# EAGLE schematic 1203_05 (EAGLE 7.1.0)
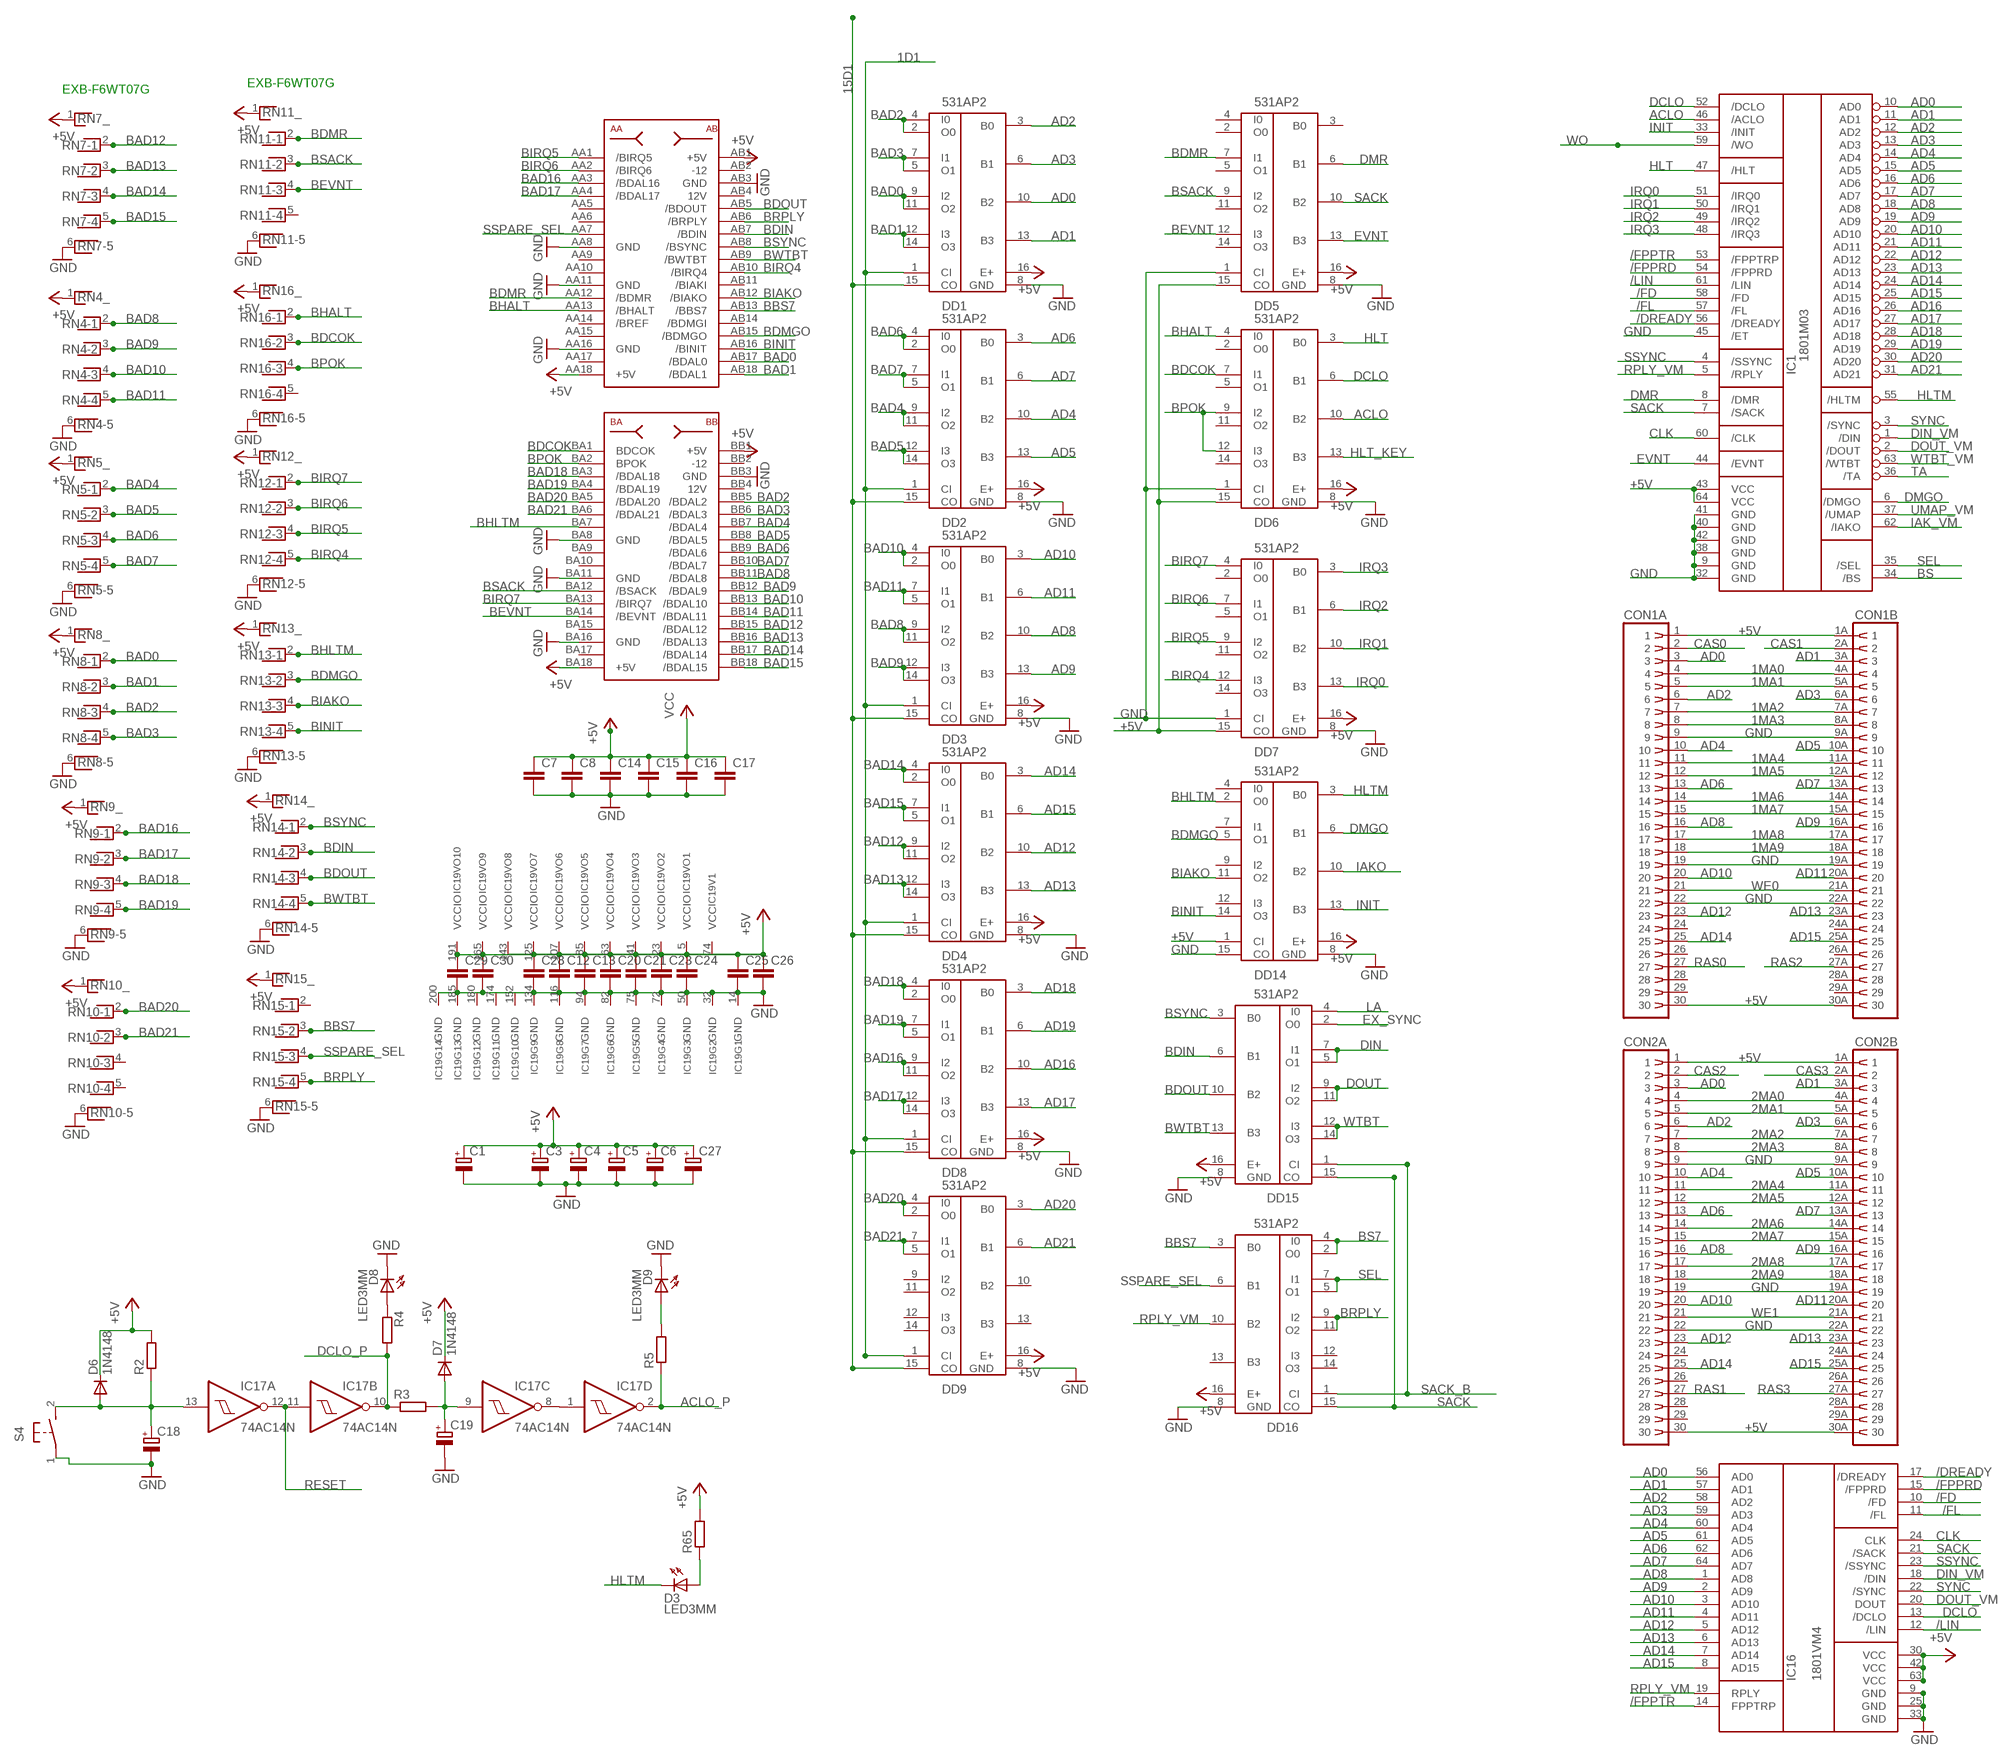
[diagram p0: schematic, sheet 1, part 1 of 2]
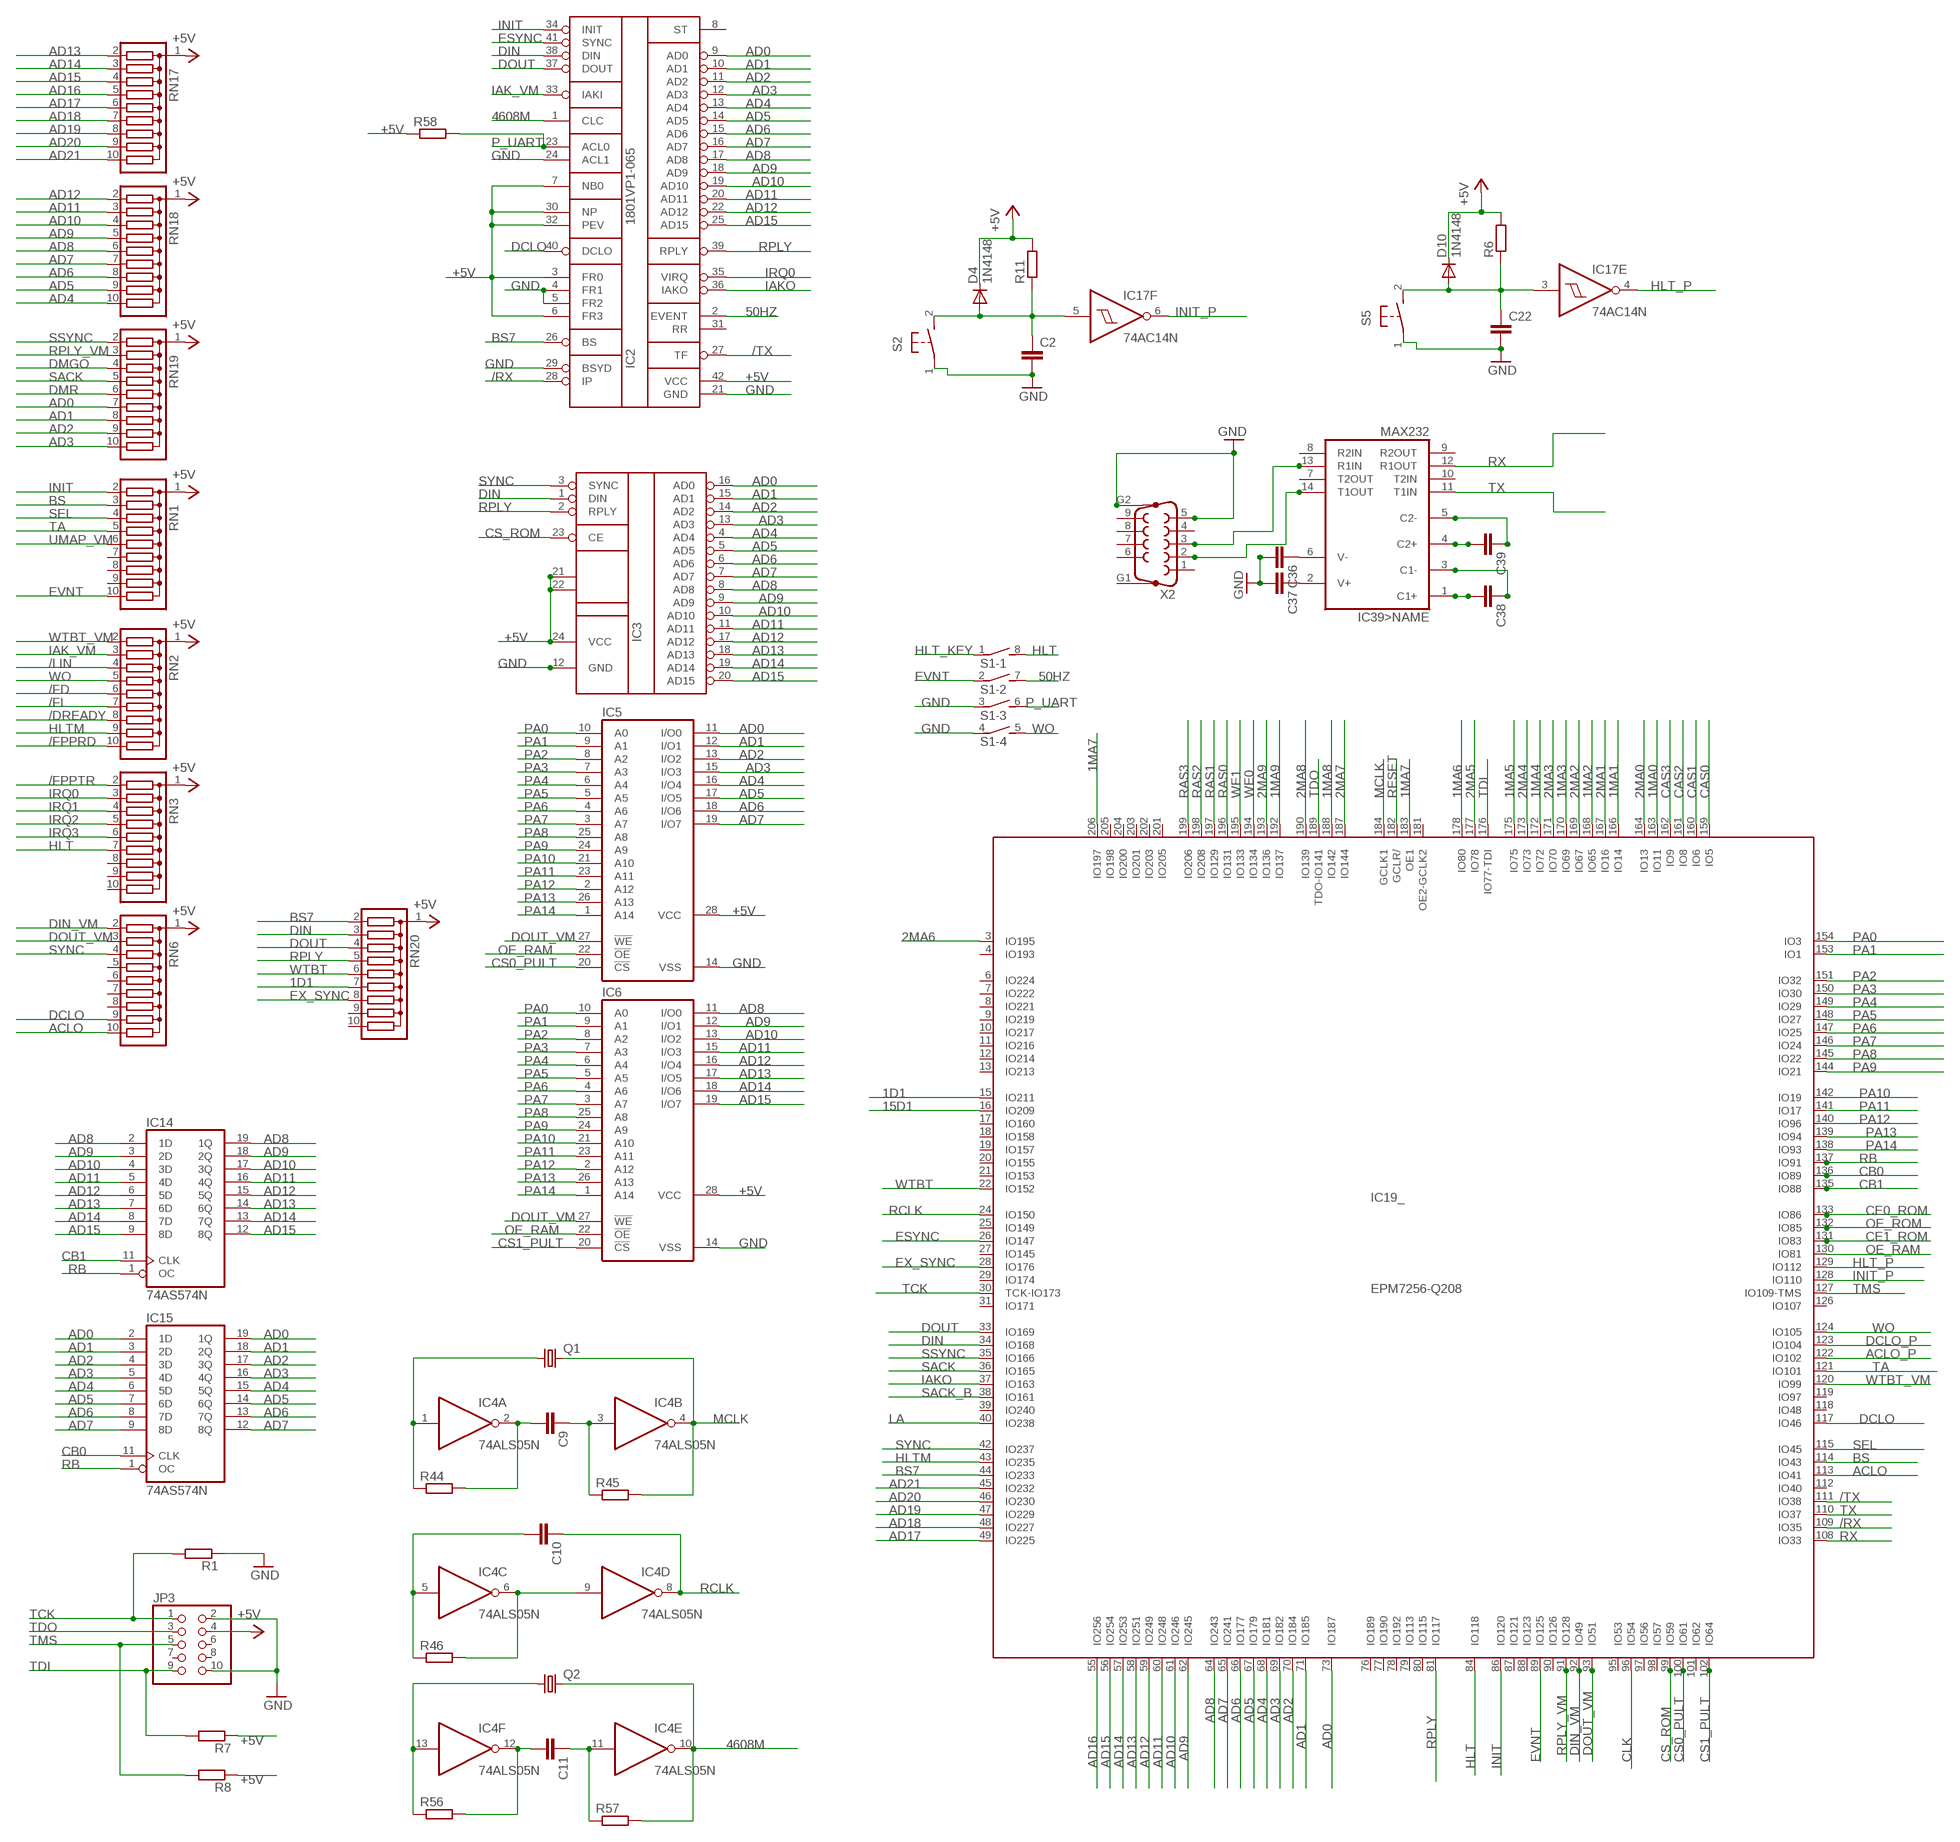
[diagram p1: schematic, sheet 1, part 2 of 2]

## Parts
C1  CPOL-EUCT6032  [CT6032]
C2  C-EU050-024X044  [C050-024X044]
C3  CPOL-EUCT6032  [CT6032]
C4  CPOL-EUCT6032  [CT6032]
C5  CPOL-EUB45181A  [B45181A]
C6  CPOL-EUCT6032  [CT6032]
C7  C-EU050-024X044  [C050-024X044]
C8  C-EU050-024X044  [C050-024X044]
C9  C-EUC0805  [C0805]
C10  C-EU025-024X044  [C025-024X044]
C11  C-EUC0805  [C0805]
C12  C-EUC0805  [C0805]
C13  C-EUC0805  [C0805]
C14  C-EU050-024X044  [C050-024X044]
C15  C-EU050-024X044  [C050-024X044]
C16  C-EU050-024X044  [C050-024X044]
C17  C-EU050-024X044  [C050-024X044]
C18  CPOL-EUE2.5-5  [E2,5-5]
C19  CPOL-EUE2.5-5  [E2,5-5]
C20  C-EUC0805  [C0805]
C21  C-EUC0805  [C0805]
C22  C-EU050-024X044  [C050-024X044]
C23  C-EU050-024X044  [C050-024X044]
C24  C-EU050-024X044  [C050-024X044]
C25  C-EU050-024X044  [C050-024X044]
C26  C-EU050-024X044  [C050-024X044]
C27  CPOL-EUCT6032  [CT6032]
C28  C-EU050-024X044  [C050-024X044]
C29  C-EU050-024X044  [C050-024X044]
C30  C-EU050-024X044  [C050-024X044]
C36  C-EU025-024X044  [C025-024X044]
C37  C-EU025-024X044  [C025-024X044]
C38  C-EU025-024X044  [C025-024X044]
C39  C-EU025-024X044  [C025-024X044]
CON1  SIMM30-2  [SIMM30-2]
CON2  SIMM30-2  [SIMM30-2]
D3  LED3MM  [LED3MM]
D4  1N4148  [DO35-10]
D6  1N4148  [DO35-10]
D7  1N4148  [DO35-10]
D8  LED3MM  [LED3MM]
D9  LED3MM  [LED3MM]
D10  1N4148  [DO35-10]
DD1  531AP2  [DIL16]
DD2  531AP2  [DIL16]
DD3  531AP2  [DIL16]
DD4  531AP2  [DIL16]
DD5  531AP2  [DIL16]
DD6  531AP2  [DIL16]
DD7  531AP2  [DIL16]
DD8  531AP2  [DIL16]
DD9  531AP2  [DIL16]
DD14  531AP2  [DIL16]
DD15  531AP2  [DIL16]
DD16  531AP2  [DIL16]
IC1  1801M03  [DIL64]
IC2  1801VP1-065  [1801]
IC3  1801RE2  [DIL24]
IC4  74ALS05N  [DIL14]
IC5  62832P  [DIL28-3]
IC6  62832P  [DIL28-3]
IC14  74AS574N  [DIL20]
IC15  74AS574N  [DIL20]
IC16  1801VM4  [1801VM4]
IC17  74AC14N  [DIL14]
IC19  EPM7256-Q208  [RQFP208]
IC39  MAX232  [DIL16]
JP3  PINHD-2X5  [2X05]
Q1  HC49U70  [HC49U70]
Q2  HC49U70  [HC49U70]
R1  R-EU_M0805  [M0805]
R2  R-EU_0207/10  [0207/10]
R3  R-EU_0207/10  [0207/10]
R4  R-EU_M0805  [M0805]
R5  R-EU_M0805  [M0805]
R6  R-EU_0207/10  [0207/10]
R7  R-EU_M0805  [M0805]
R8  R-EU_M0805  [M0805]
R11  R-EU_0207/10  [0207/10]
R44  R-EU_M0805  [M0805]
R45  R-EU_M0805  [M0805]
R46  R-EU_0207/10  [0207/10]
R56  R-EU_M0805  [M0805]
R57  R-EU_M0805  [M0805]
R58  R-EU_0207/10  [0207/10]
R65  R-EU_M0805  [M0805]
RN1  G09R  [SIL10]
RN2  G09R  [SIL10]
RN3  G09R  [SIL10]
RN4  RNX5  [RN-6]
RN5  RNX5  [RN-6]
RN6  G09R  [SIL10]
RN7  RNX5  [RN-6]
RN8  RNX5  [RN-6]
RN9  RNX5  [RN-6]
RN10  RNX5  [RN-6]
RN11  RNX5  [RN-6]
RN12  RNX5  [RN-6]
RN13  RNX5  [RN-6]
RN14  RNX5  [RN-6]
RN15  RNX5  [RN-6]
RN16  RNX5  [RN-6]
RN17  G09R  [SIL10]
RN18  G09R  [SIL10]
RN19  G09R  [SIL10]
RN20  G09R  [SIL10]
S1  DIP04SB  [DIP04SB]
S2  31-XX  [B3F-31XX]
S4  31-XX  [B3F-31XX]
S5  31-XX  [B3F-31XX]
X2  F09HP  [F09HP]
XP1  CON1  [CON1]

## Nets
1D1: DD1.1(CI) DD2.1(CI) DD3.1(CI) DD4.1(CI) DD8.1(CI) DD9.1(CI) IC19.15(_:IO211) RN20.7
1MA0: CON1.4 CON1.4A IC19.163(_:IO11)
1MA1: CON1.5 CON1.5A IC19.166(_:IO14)
1MA2: CON1.7 CON1.7A IC19.168(_:IO65)
1MA3: CON1.8 CON1.8A IC19.170(_:IO69)
1MA4: CON1.11 CON1.11A IC19.172(_:IO72)
1MA5: CON1.12 CON1.12A IC19.175(_:IO75)
1MA6: CON1.14 CON1.14A IC19.178(_:IO80)
1MA7: CON1.15 CON1.15A IC19.183(_:OE1) IC19.206(_:IO197)
1MA8: CON1.17 CON1.17A IC19.188(_:IO142)
1MA9: CON1.18 CON1.18A IC19.192(_:IO137)
2MA0: CON2.4 CON2.4A IC19.164(_:IO13)
2MA1: CON2.5 CON2.5A IC19.167(_:IO16)
2MA2: CON2.7 CON2.7A IC19.169(_:IO67)
2MA3: CON2.8 CON2.8A IC19.171(_:IO70)
2MA4: CON2.11 CON2.11A IC19.173(_:IO73)
2MA5: CON2.12 CON2.12A IC19.177(_:IO78)
2MA6: CON2.14 CON2.14A IC19.3(_:IO195)
2MA7: CON2.15 CON2.15A IC19.187(_:IO144)
2MA8: CON2.17 CON2.17A IC19.190(_:IO139)
2MA9: CON2.18 CON2.18A IC19.193(_:IO136)
15D1: DD1.15(CO) DD2.15(CO) DD3.15(CO) DD4.15(CO) DD8.15(CO) DD9.15(CO) IC19.16(_:IO209)
50HZ: IC2.2(EVENT) S1.7
4608M: IC2.1(CLC) IC4.10(E:O) Q2.2 R57.2
+5V: C1.+ C3.+ C4.+ C5.+ C6.+ C7.1 C8.1 C12.1 C13.1 C14.1 C15.1 C16.1 C17.1 C20.1 C21.1 C23.1 C24.1 C25.1 C26.1 C27.+ C28.1 C29.1 C30.1 CON1.1 CON1.1A CON1.30 CON1.30A CON2.1 CON2.1A CON2.30 CON2.30A D4.K(C) D6.K(C) D7.K(C) D10.K(C) DD1.16(E+) DD2.16(E+) DD3.16(E+) DD4.16(E+) DD5.15(CO) DD5.16(E+) DD6.15(CO) DD6.16(E+) DD7.15(CO) DD7.16(E+) DD8.16(E+) DD9.16(E+) DD14.1(CI) DD14.16(E+) DD15.16(E+) DD16.16(E+) IC1.43(VCC) IC1.64(VCC) IC2.3(FR0) IC2.6(FR3) IC2.7(NB0) IC2.30(NP) IC2.32(PEV) IC2.42(VCC) IC3.21(F0) IC3.22(F1) IC3.24(VCC) IC5.28(VCC) IC6.28(VCC) IC16.30(VCC) IC16.42(VCC) IC16.63(VCC) IC19.5(VO1:VCCIO) IC19.23(VO2:VCCIO) IC19.41(VO3:VCCIO) IC19.63(VO4:VCCIO) IC19.74(V1:VCC) IC19.85(VO5:VCCIO) IC19.107(VO6:VCCIO) IC19.125(VO7:VCCIO) IC19.143(VO8:VCCIO) IC19.165(VO9:VCCIO) IC19.191(VO10:VCCIO) JP3.4 R2.2 R6.2 R7.1 R8.1 R11.2 R58.1 R65.2 RN1.1 RN2.1 RN3.1 RN4.1 RN5.1 RN6.1 RN7.1 RN8.1 RN9.1 RN10.1 RN11.1 RN12.1 RN13.1 RN14.1 RN15.1 RN16.1 RN17.1 RN18.1 RN19.1 RN20.1 XP1.AA18(+5V) XP1.AB1(+5V) XP1.BA18(+5V) XP1.BB1(+5V) ; supply symbol labelled VCC
/DREADY: IC1.56(/DREADY) IC16.17(/DREADY) RN2.8
/FD: IC1.58(/FD) IC16.10(/FD) RN2.6
/FL: IC1.57(/FL) IC16.11(/FL) RN2.7
/FPPRD: IC1.54(/FPPRD) IC16.15(/FPPRD) RN2.10
/FPPTR: IC1.53(/FPPTRP) IC16.14(FPPTRP) RN3.2
/LIN: IC1.61(/LIN) IC16.12(/LIN) RN2.4
/RX: IC2.28(IP) IC19.109(_:IO35)
/TX: IC2.27(TF) IC19.111(_:IO38)
ACLO: DD6.10(B2) IC1.46(/ACLO) IC19.113(_:IO41) RN6.10
ACLO_P: IC17.2(D:O) IC19.122(_:IO102) R5.1
AD0: CON1.3 CON2.3 DD1.10(B2) IC1.10(AD0) IC2.9(AD0) IC3.16(AD0) IC5.11(I/O0) IC15.2(1D) IC15.19(1Q) IC16.56(AD0) IC19.73(_:IO187) RN19.7
AD1: CON1.3A CON2.3A DD1.13(B3) IC1.11(AD1) IC2.10(AD1) IC3.15(AD1) IC5.12(I/O1) IC15.3(2D) IC15.18(2Q) IC16.57(AD1) IC19.71(_:IO185) RN19.8
AD2: CON1.6 CON2.6 DD1.3(B0) IC1.12(AD2) IC2.11(AD2) IC3.14(AD2) IC5.13(I/O2) IC15.4(3D) IC15.17(3Q) IC16.58(AD2) IC19.70(_:IO184) RN19.9
AD3: CON1.6A CON2.6A DD1.6(B1) IC1.13(AD3) IC2.12(AD3) IC3.13(AD3) IC5.15(I/O3) IC15.5(4D) IC15.16(4Q) IC16.59(AD3) IC19.69(_:IO182) RN19.10
AD4: CON1.10 CON2.10 DD2.10(B2) IC1.14(AD4) IC2.13(AD4) IC3.4(AD4) IC5.16(I/O4) IC15.6(5D) IC15.15(5Q) IC16.60(AD4) IC19.68(_:IO181) RN18.10
AD5: CON1.10A CON2.10A DD2.13(B3) IC1.15(AD5) IC2.14(AD5) IC3.5(AD5) IC5.17(I/O5) IC15.7(6D) IC15.14(6Q) IC16.61(AD5) IC19.67(_:IO179) RN18.9
AD6: CON1.13 CON2.13 DD2.3(B0) IC1.16(AD6) IC2.15(AD6) IC3.6(AD6) IC5.18(I/O6) IC15.8(7D) IC15.13(7Q) IC16.62(AD6) IC19.66(_:IO177) RN18.8
AD7: CON1.13A CON2.13A DD2.6(B1) IC1.17(AD7) IC2.16(AD7) IC3.7(AD7) IC5.19(I/O7) IC15.9(8D) IC15.12(8Q) IC16.64(AD7) IC19.65(_:IO241) RN18.7
AD8: CON1.16 CON2.16 DD3.10(B2) IC1.18(AD8) IC2.17(AD8) IC3.8(AD8) IC6.11(I/O0) IC14.2(1D) IC14.19(1Q) IC16.1(AD8) IC19.64(_:IO243) RN18.6
AD9: CON1.16A CON2.16A DD3.13(B3) IC1.19(AD9) IC2.18(AD9) IC3.9(AD9) IC6.12(I/O1) IC14.3(2D) IC14.18(2Q) IC16.2(AD9) IC19.62(_:IO245) RN18.5
AD10: CON1.20 CON2.20 DD3.3(B0) IC1.20(AD10) IC2.19(AD10) IC3.10(AD10) IC6.13(I/O2) IC14.4(3D) IC14.17(3Q) IC16.3(AD10) IC19.61(_:IO246) RN18.4
AD11: CON1.20A CON2.20A DD3.6(B1) IC1.21(AD11) IC2.20(AD11) IC3.11(AD11) IC6.15(I/O3) IC14.5(4D) IC14.16(4Q) IC16.4(AD11) IC19.60(_:IO248) RN18.3
AD12: CON1.23 CON2.23 DD4.10(B2) IC1.22(AD12) IC2.22(AD12) IC3.17(AD12) IC6.16(I/O4) IC14.6(5D) IC14.15(5Q) IC16.5(AD12) IC19.59(_:IO249) RN18.2
AD13: CON1.23A CON2.23A DD4.13(B3) IC1.23(AD13) IC3.18(AD13) IC6.17(I/O5) IC14.7(6D) IC14.14(6Q) IC16.6(AD13) IC19.58(_:IO251) RN17.2
AD14: CON1.25 CON2.25 DD4.3(B0) IC1.24(AD14) IC3.19(AD14) IC6.18(I/O6) IC14.8(7D) IC14.13(7Q) IC16.7(AD14) IC19.57(_:IO253) RN17.3
AD15: CON1.25A CON2.25A DD4.6(B1) IC1.25(AD15) IC2.25(AD15) IC3.20(AD15) IC6.19(I/O7) IC14.9(8D) IC14.12(8Q) IC16.8(AD15) IC19.56(_:IO254) RN17.4
AD16: DD8.10(B2) IC1.26(AD16) IC19.55(_:IO256) RN17.5
AD17: DD8.13(B3) IC1.27(AD17) IC19.49(_:IO225) RN17.6
AD18: DD8.3(B0) IC1.28(AD18) IC19.48(_:IO227) RN17.7
AD19: DD8.6(B1) IC1.29(AD19) IC19.47(_:IO229) RN17.8
AD20: DD9.3(B0) IC1.30(AD20) IC19.46(_:IO230) RN17.9
AD21: DD9.6(B1) IC1.31(AD21) IC19.45(_:IO232) RN17.10
BAD0: DD1.9(I2) DD1.11(O2) RN8.2 XP1.AB17(/BDAL0)
BAD1: DD1.12(I3) DD1.14(O3) RN8.3 XP1.AB18(/BDAL1)
BAD2: DD1.2(O0) DD1.4(I0) RN8.4 XP1.BB5(/BDAL2)
BAD3: DD1.5(O1) DD1.7(I1) RN8.5 XP1.BB6(/BDAL3)
BAD4: DD2.9(I2) DD2.11(O2) RN5.2 XP1.BB7(/BDAL4)
BAD5: DD2.12(I3) DD2.14(O3) RN5.3 XP1.BB8(/BDAL5)
BAD6: DD2.2(O0) DD2.4(I0) RN5.4 XP1.BB9(/BDAL6)
BAD7: DD2.5(O1) DD2.7(I1) RN5.5 XP1.BB10(/BDAL7)
BAD8: DD3.9(I2) DD3.11(O2) RN4.2 XP1.BB11(/BDAL8)
BAD9: DD3.12(I3) DD3.14(O3) RN4.3 XP1.BB12(/BDAL9)
BAD10: DD3.2(O0) DD3.4(I0) RN4.4 XP1.BB13(/BDAL10)
BAD11: DD3.5(O1) DD3.7(I1) RN4.5 XP1.BB14(/BDAL11)
BAD12: DD4.9(I2) DD4.11(O2) RN7.2 XP1.BB15(/BDAL12)
BAD13: DD4.12(I3) DD4.14(O3) RN7.3 XP1.BB16(/BDAL13)
BAD14: DD4.2(O0) DD4.4(I0) RN7.4 XP1.BB17(/BDAL14)
BAD15: DD4.5(O1) DD4.7(I1) RN7.5 XP1.BB18(/BDAL15)
BAD16: DD8.9(I2) DD8.11(O2) RN9.2 XP1.AA3(/BDAL16)
BAD17: DD8.12(I3) DD8.14(O3) RN9.3 XP1.AA4(/BDAL17)
BAD18: DD8.2(O0) DD8.4(I0) RN9.4 XP1.BA3(/BDAL18)
BAD19: DD8.5(O1) DD8.7(I1) RN9.5 XP1.BA4(/BDAL19)
BAD20: DD9.2(O0) DD9.4(I0) RN10.2 XP1.BA5(/BDAL20)
BAD21: DD9.5(O1) DD9.7(I1) RN10.3 XP1.BA6(/BDAL21)
BBS7: DD16.3(B0) RN15.3 XP1.AB13(/BBS7)
BDCOK: DD6.7(I1) RN16.3 XP1.BA1(BDCOK)
BDIN: DD15.6(B1) RN14.3 XP1.AB7(/BDIN)
BDMGO: DD14.5(O1) RN13.3 XP1.AB15(/BDMGO)
BDMR: DD5.7(I1) RN11.2 XP1.AA12(/BDMR)
BDOUT: DD15.10(B2) RN14.4 XP1.AB5(/BDOUT)
BEVNT: DD5.12(I3) RN11.4 XP1.BA14(/BEVNT)
BHALT: DD6.4(I0) RN16.2 XP1.AA13(/BHALT)
BHLTM: DD14.2(O0) RN13.2 XP1.BA7
BIAKO: DD14.11(O2) RN13.4 XP1.AB12(/BIAKO)
BINIT: DD14.14(O3) RN13.5 XP1.AB16(/BINIT)
BIRQ4: DD7.12(I3) RN12.5 XP1.AB10(/BIRQ4)
BIRQ5: DD7.9(I2) RN12.4 XP1.AA1(/BIRQ5)
BIRQ6: DD7.7(I1) RN12.3 XP1.AA2(/BIRQ6)
BIRQ7: DD7.4(I0) RN12.2 XP1.BA13(/BIRQ7)
BPOK: DD6.9(I2) DD6.12(I3) RN16.4 XP1.BA2(BPOK)
BRPLY: DD16.9(I2) DD16.11(O2) RN15.5 XP1.AB6(/BRPLY)
BS: IC1.34(/BS) IC19.114(_:IO43) RN1.3
BS7: DD16.2(O0) DD16.4(I0) IC2.26(BS) IC19.44(_:IO233) RN20.2
BSACK: DD5.9(I2) RN11.3 XP1.BA12(/BSACK)
BSYNC: DD15.3(B0) RN14.2 XP1.AB8(/BSYNC)
BWTBT: DD15.13(B3) RN14.5 XP1.AB9(/BWTBT)
CAS0: CON1.2 IC19.159(_:IO5)
CAS1: CON1.2A IC19.160(_:IO6)
CAS2: CON2.2 IC19.161(_:IO8)
CAS3: CON2.2A IC19.162(_:IO9)
CB0: IC15.11(CLK) IC19.136(_:IO89)
CB1: IC14.11(CLK) IC19.135(_:IO88)
CE0_ROM: IC19.133(_:IO86)
CE1_ROM: IC19.131(_:IO83)
CLK: IC1.60(/CLK) IC16.24(CLK) IC19.96(_:IO54)
CS0_PULT: IC5.20(!CS) IC19.100(_:IO61)
CS1_PULT: IC6.20(!CS) IC19.102(_:IO64)
CS_ROM: IC3.23(CE) IC19.99(_:IO59)
DCLO: DD6.6(B1) IC1.52(/DCLO) IC2.40(DCLO) IC16.13(/DCLO) IC19.117(_:IO46) RN6.9
DCLO_P: IC17.10(B:O) IC19.123(_:IO104) R3.1 R4.2
DIN: DD15.5(O1) DD15.7(I1) IC2.38(DIN) IC3.1(DIN) IC19.34(_:IO168) RN20.3
DIN_VM: IC1.1(/DIN) IC16.18(/DIN) IC19.92(_:IO49) RN6.2
DMGO: DD14.6(B1) IC1.6(/DMGO) RN19.4
DMR: DD5.6(B1) IC1.8(/DMR) RN19.6
DOUT: DD15.9(I2) DD15.11(O2) IC2.37(DOUT) IC19.33(_:IO169) RN20.4
DOUT_VM: IC1.2(/DOUT) IC5.27(!WE) IC6.27(!WE) IC16.20(DOUT) IC19.93(_:IO51) RN6.3
ESYNC: IC2.41(SYNC) IC19.26(_:IO147)
EVNT: DD5.13(B3) IC1.44(/EVNT) IC19.89(_:IO125) RN1.10 S1.2
EX_SYNC: DD15.2(O0) IC19.28(_:IO176) RN20.8
GND: C1.- C2.2 C3.- C4.- C5.- C6.- C7.2 C8.2 C12.2 C13.2 C14.2 C15.2 C16.2 C17.2 C18.- C19.- C20.2 C21.2 C22.2 C23.2 C24.2 C25.2 C26.2 C27.- C28.2 C29.2 C30.2 C36.2 C37.2 CON1.9 CON1.9A CON1.19 CON1.19A CON1.22 CON1.22A CON2.9 CON2.9A CON2.19 CON2.19A CON2.22 CON2.22A D8.K(C) D9.K(C) DD1.8(GND) DD2.8(GND) DD3.8(GND) DD4.8(GND) DD5.1(CI) DD5.8(GND) DD6.1(CI) DD6.8(GND) DD7.1(CI) DD7.8(GND) DD8.8(GND) DD9.8(GND) DD14.8(GND) DD14.15(CO) DD15.8(GND) DD16.8(GND) IC1.9(GND) IC1.32(GND) IC1.38(GND) IC1.40(GND) IC1.41(GND) IC1.42(GND) IC1.45(/ET) IC2.4(FR1) IC2.5(FR2) IC2.21(GND) IC2.24(ACL1) IC2.29(BSYD) IC3.12(GND) IC5.14(VSS) IC6.14(VSS) IC16.9(GND) IC16.25(GND) IC16.33(GND) IC19.14(GND) IC19.32(GND) IC19.50(GND) IC19.72(GND) IC19.75(GND) IC19.82(GND) IC19.94(GND) IC19.116(GND) IC19.134(GND) IC19.152(GND) IC19.174(GND) IC19.180(GND) IC19.185(GND) IC19.200(GND) JP3.2 JP3.10 R1.1 RN4.6 RN5.6 RN7.6 RN8.6 RN9.6 RN10.6 RN11.6 RN12.6 RN13.6 RN14.6 RN15.6 RN16.6 S1.3 S1.4 S2.1 S4.1 S5.1 X2.5 X2.G2 XP1.AA8(GND) XP1.AA11(GND) XP1.AA16(GND) XP1.AB3(GND) XP1.BA8(GND) XP1.BA11(GND) XP1.BA16(GND) XP1.BB3(GND)
HLT: DD6.3(B0) IC1.47(/HLT) IC19.84(_:IO118) RN3.7 S1.8
HLT_KEY: DD6.13(B3) S1.1
HLT_P: IC17.4(E:O) IC19.129(_:IO112)
HLTM: D3.K(C) DD14.3(B0) IC1.55(/HLTM) IC19.43(_:IO235) RN2.9
IAK_VM: IC1.62(/IAKO) IC2.33(IAKI) RN2.3
IAKO: DD14.10(B2) IC2.36(IAKO) IC19.37(_:IO163)
INIT: DD14.13(B3) IC1.33(/INIT) IC2.34(INIT) IC19.86(_:IO120) RN1.2
INIT_P: IC17.6(F:O) IC19.128(_:IO110)
IRQ0: DD7.13(B3) IC1.51(/IRQ0) IC2.35(VIRQ) RN3.3
IRQ1: DD7.10(B2) IC1.50(/IRQ1) RN3.4
IRQ2: DD7.6(B1) IC1.49(/IRQ2) RN3.5
IRQ3: DD7.3(B0) IC1.48(/IRQ3) RN3.6
LA: DD15.4(I0) IC19.40(_:IO238)
MCLK: IC4.4(B:O) IC19.184(_:GCLK1) Q1.2 R45.2
N$3: IC17.1(D:I) IC17.8(C:O)
N$4: C38.1 IC39.3(>NAME:C1-)
N$5: D9.A R5.2
N$6: C18.+ D6.A IC17.13(A:I) R2.1 S4.2
N$7: IC4.1(A:I) Q1.1 R44.1
N$8: D3.A R65.1
N$82: C9.2 IC4.2(A:O) R44.2
N$83: C19.+ D7.A IC17.9(C:I) R3.2
N$84: D8.A R4.1
N$86: C22.1 D10.A IC17.3(E:I) R6.1 S5.2
N$92: C2.1 D4.A IC17.5(F:I) R11.1 S2.2
N$96: IC4.13(F:I) Q2.1 R56.1
N$127: C9.1 IC4.3(B:I) R45.1
N$129: IC4.6(C:O) IC4.9(D:I) R46.2
N$134: C10.2 IC4.5(C:I) R46.1
N$136: C38.2 IC39.1(>NAME:C1+)
N$139: C39.2 IC39.4(>NAME:C2+)
N$140: C39.1 IC39.5(>NAME:C2-)
N$141: IC39.14(>NAME:T1OUT) X2.2
N$142: IC39.13(>NAME:R1IN) X2.3
N$143: C36.1 IC39.6(>NAME:V-)
N$144: C37.1 IC39.2(>NAME:V+)
N$148: C11.2 IC4.12(F:O) R56.2
N$149: C11.1 IC4.11(E:I) R57.1
OE_RAM: IC5.22(!OE) IC6.22(!OE) IC19.130(_:IO81)
OE_ROM: IC19.132(_:IO85)
P_UART: IC2.23(ACL0) R58.2 S1.6
PA0: IC5.10(A0) IC6.10(A0) IC19.154(_:IO3)
PA1: IC5.9(A1) IC6.9(A1) IC19.153(_:IO1)
PA2: IC5.8(A2) IC6.8(A2) IC19.151(_:IO32)
PA3: IC5.7(A3) IC6.7(A3) IC19.150(_:IO30)
PA4: IC5.6(A4) IC6.6(A4) IC19.149(_:IO29)
PA5: IC5.5(A5) IC6.5(A5) IC19.148(_:IO27)
PA6: IC5.4(A6) IC6.4(A6) IC19.147(_:IO25)
PA7: IC5.3(A7) IC6.3(A7) IC19.146(_:IO24)
PA8: IC5.25(A8) IC6.25(A8) IC19.145(_:IO22)
PA9: IC5.24(A9) IC6.24(A9) IC19.144(_:IO21)
PA10: IC5.21(A10) IC6.21(A10) IC19.142(_:IO19)
PA11: IC5.23(A11) IC6.23(A11) IC19.141(_:IO17)
PA12: IC5.2(A12) IC6.2(A12) IC19.140(_:IO96)
PA13: IC5.26(A13) IC6.26(A13) IC19.139(_:IO94)
PA14: IC5.1(A14) IC6.1(A14) IC19.138(_:IO93)
RAS0: CON1.27 IC19.196(_:IO131)
RAS1: CON2.27 IC19.197(_:IO129)
RAS2: CON1.27A IC19.198(_:IO208)
RAS3: CON2.27A IC19.199(_:IO206)
RB: IC14.1(OC) IC15.1(OC) IC19.137(_:IO91)
RCLK: C10.1 IC4.8(D:O) IC19.24(_:IO150)
RESET: IC17.11(B:I) IC17.12(A:O) IC19.182(_:GCLR/)
RPLY: IC2.39(RPLY) IC3.2(RPLY) IC19.81(_:IO117) RN20.5
RPLY_VM: DD16.10(B2) IC1.5(/RPLY) IC16.19(RPLY) IC19.91(_:IO128) RN19.3
RX: IC19.108(_:IO33) IC39.12(>NAME:R1OUT)
SACK: DD5.10(B2) DD15.15(CO) DD16.15(CO) IC1.7(/SACK) IC16.21(/SACK) IC19.36(_:IO165) RN19.5
SACK_B: DD15.1(CI) DD16.1(CI) IC19.38(_:IO161)
SEL: DD16.5(O1) DD16.7(I1) IC1.35(/SEL) IC19.115(_:IO45) RN1.4
SSPARE_SEL: DD16.6(B1) RN15.4 XP1.AA7
SSYNC: IC1.4(/SSYNC) IC16.23(/SSYNC) IC19.35(_:IO166) RN19.2
SYNC: IC1.3(/SYNC) IC3.3(SYNC) IC16.22(/SYNC) IC19.42(_:IO237) RN6.4
TA: IC1.36(/TA) IC19.121(_:IO101) RN1.5
TCK: IC19.30(_:TCK-IO173) JP3.1 R1.2
TDI: IC19.176(_:IO77-TDI) JP3.9 R7.2
TDO: IC19.189(_:TDO-IO141) JP3.3
TMS: IC19.127(_:IO109-TMS) JP3.5 R8.2
TX: IC19.110(_:IO37) IC39.11(>NAME:T1IN)
UMAP_VM: IC1.37(/UMAP) RN1.6
WE0: CON1.21 CON1.21A IC19.194(_:IO134)
WE1: CON2.21 CON2.21A IC19.195(_:IO133)
WO: IC1.59(/WO) IC19.124(_:IO105) RN2.5 S1.5
WTBT: DD15.12(I3) DD15.14(O3) IC19.22(_:IO152) RN20.6
WTBT_VM: IC1.63(/WTBT) IC19.120(_:IO99) RN2.2
Unconnected: CON1.24 CON1.24A CON1.26 CON1.26A CON1.28 CON1.28A CON1.29 CON1.29A CON2.24 CON2.24A CON2.26 CON2.26A CON2.28 CON2.28A CON2.29 CON2.29A DD5.2(O0) DD5.3(B0) DD5.4(I0) DD5.5(O1) DD5.11(O2) DD5.14(O3) DD6.2(O0) DD6.5(O1) DD6.11(O2) DD6.14(O3) DD7.2(O0) DD7.5(O1) DD7.11(O2) DD7.14(O3) DD9.9(I2) DD9.10(B2) DD9.11(O2) DD9.12(I3) DD9.13(B3) DD9.14(O3) DD14.4(I0) DD14.7(I1) DD14.9(I2) DD14.12(I3) DD16.12(I3) DD16.13(B3) DD16.14(O3) IC2.8(ST) IC2.31(RR) IC19.1(NC1:NC) IC19.2(NC2:NC) IC19.4(_:IO193) IC19.6(_:IO224) IC19.7(_:IO222) IC19.8(_:IO221) IC19.9(_:IO219) IC19.10(_:IO217) IC19.11(_:IO216) IC19.12(_:IO214) IC19.13(_:IO213) IC19.17(_:IO160) IC19.18(_:IO158) IC19.19(_:IO157) IC19.20(_:IO155) IC19.21(_:IO153) IC19.25(_:IO149) IC19.27(_:IO145) IC19.29(_:IO174) IC19.31(_:IO171) IC19.39(_:IO240) IC19.51(NC3:NC) IC19.52(NC4:NC) IC19.53(NC5:NC) IC19.54(NC6:NC) IC19.76(_:IO189) IC19.77(_:IO190) IC19.78(_:IO192) IC19.79(_:IO113) IC19.80(_:IO115) IC19.87(_:IO121) IC19.88(_:IO123) IC19.90(_:IO126) IC19.95(_:IO53) IC19.97(_:IO56) IC19.98(_:IO57) IC19.101(_:IO62) IC19.103(NC7:NC) IC19.104(NC8:NC) IC19.105(NC9:NC) IC19.106(NC10:NC) IC19.112(_:IO40) IC19.118(_:IO48) IC19.119(_:IO97) IC19.126(_:IO107) IC19.155(NC11:NC) IC19.156(NC12:NC) IC19.157(NC13:NC) IC19.158(NC14:NC) IC19.181(_:OE2-GCLK2) IC19.201(_:IO205) IC19.202(_:IO203) IC19.203(_:IO201) IC19.204(_:IO200) IC19.205(_:IO198) IC19.207(NC15:NC) IC19.208(NC16:NC) IC39.7(>NAME:T2OUT) IC39.8(>NAME:R2IN) IC39.9(>NAME:R2OUT) IC39.10(>NAME:T2IN) IC39.15(P:GND) IC39.16(P:+5V) JP3.6 JP3.7 JP3.8 RN1.7 RN1.8 RN1.9 RN3.8 RN3.9 RN3.10 RN6.5 RN6.6 RN6.7 RN6.8 RN10.4 RN10.5 RN11.5 RN15.2 RN16.5 RN20.9 RN20.10 X2.1 X2.4 X2.6 X2.7 X2.8 X2.9 X2.G1 XP1.AA5 XP1.AA6 XP1.AA9 XP1.AA10 XP1.AA14(/BREF) XP1.AA15 XP1.AA17 XP1.AB2(-12) XP1.AB4(12V) XP1.AB11(/BIAKI) XP1.AB14(/BDMGI) XP1.BA9 XP1.BA10 XP1.BA15 XP1.BA17 XP1.BB2(-12) XP1.BB4(12V)

## Notes on the sheet
- EXB-F6WT07G
- EXB-F6WT07G

## Power pins joined to a net without a drawn wire
+5V: IC4.14(P:VCC) IC14.20(VCC) IC15.20(VCC) IC17.14(P:VCC) IC19.83(V2:VCC) IC19.179(V3:VCC) IC19.186(V4:VCC)
GND: IC4.7(P:GND) IC14.10(GND) IC15.10(GND) IC17.7(P:GND)

## Library data of the parts
C1 C3-C6 C18 C19 C27 = rcl:CPOL-EU: POLARIZED CAPACITOR, European symbol
C2 C7-C17 C20-C26 C28-C30 C36-C39 = rcl:C-EU: CAPACITOR, European symbol
CON1 CON2 = con-amp:SIMM30-2: AMP connector
D3 D8 D9 = led:LED3MM: LED 3 mm, round
D4 D6 D7 D10 = diode:1N4148: DIODE high speed (Philips)
DD1-DD9 DD14-DD16 = pdp_dvk:531AP2
IC1 = pdp_dvk:1801M03
IC2 = pdp_dvk:1801VP1-065
IC3 = pdp_dvk:1801RE2
IC4 = 74xx-eu:74*05: Hex INVERTER, open collector
IC5 IC6 = memory-hitachi:62832P: MEMORY
IC14 IC15 = 74xx-eu:74*574: 8-bit D type FLIP FLOP bus driver
IC16 = pdp_dvk:1801VM4
IC17 = 74xx-eu:74*14: Hex schmitt trigger INVERTER
IC19 = altera:EPM7256-Q208: EPM7256S MAX 7000 family; MPN: EPM7256AEQC208-10N; OC_FARNELL: 1549440; OC_NEWARK: 51R9842
IC39 = maxim:MAX232: RS232 TRANSEIVER
JP3 = pinhead:PINHD-2X5: PIN HEADER
Q1 Q2 = crystal:HC49U70: CRYSTAL
R1-R8 R11 R44-R46 R56-R58 R65 = rcl:R-EU_: RESISTOR, European symbol
RN1-RN3 RN6 RN17-RN20 = resistor-sil:G09R: SIL RESISTOR; OC_FARNELL: unknown; OC_NEWARK: unknown
RN4 RN5 RN7-RN16 = resistor-net:RNX5: RESISTOR NETWORK; OC_FARNELL: unknown; OC_NEWARK: unknown
S1 = switch-dil:DIP04SB: DIL/CODE SWITCH
S2 S4 S5 = switch-omron:31-XX: OMRON SWITCH
X2 = con-subd:F09HP: HARTING SUB-D
XP1 = pdp_dvk:CON1